# EAGLE design Blinky (EAGLE 7.7.0)
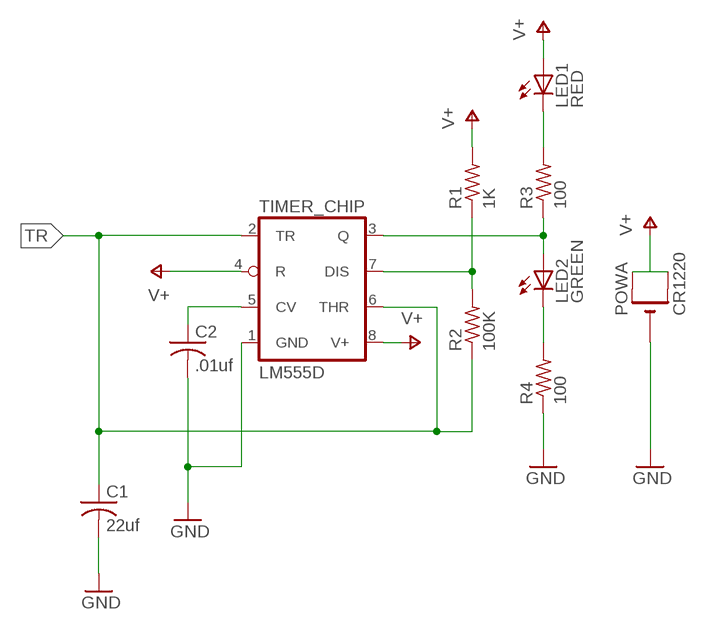
[diagram p0: schematic, sheet 1]

## Parts
C1  22uf  C-USC0805  [C0805]
C2  .01uf  C-USC0805  [C0805]
LED1  RED  LEDCHIP-LED0805  [CHIP-LED0805]
LED2  GREEN  LEDCHIP-LED0805  [CHIP-LED0805]
POWA  CR1220  CR1220SMT  [CR1220-SMD]
R1  1K  R-US_R0805  [R0805]
R2  100K  R-US_R0805  [R0805]
R3  100  R-US_R0805  [R0805]
R4  100  R-US_R0805  [R0805]
TIMER_CHIP  LM555D  [SO08]

## Nets
GND: C1.2 C2.2 POWA.- R4.1 TIMER_CHIP.1(GND)
N$1: LED1.C R3.2
N$2: LED2.A R3.1 TIMER_CHIP.3(Q)
N$3: LED2.C R4.2
N$5: R1.1 R2.2 TIMER_CHIP.7(DIS)
N$6: C2.1 TIMER_CHIP.5(CV)
TR: C1.1 R2.1 TIMER_CHIP.2(TR) TIMER_CHIP.6(THR)
V+: LED1.A POWA.+$1(+) POWA.+$2(+1) R1.2 TIMER_CHIP.4(R) TIMER_CHIP.8(V+)

## Library data of the parts
C1 = adafruit:C-US: CAPACITOR, American symbol; MF: AVX; MPN: 08056D226MAT2A; OC_FARNELL: 1867955
C2 = adafruit:C-US: CAPACITOR, American symbol; MF: AVX; MPN: 08051A101J4T4A; OC_FARNELL: 2410409
LED1 = adafruit:LED: LED OSRAM: - CHIPLED LG R971, LG N971, LY N971, LG Q971, LY Q971, LO R971, LY R971 LH N974, LH R974 LS Q976, LO Q976, LY Q976 LO Q996 - Hyper CHIPLED LW Q18S LB Q993, LB Q99A, LB R99A - SideLED LS A670, LO A670, LY A670, LG A670, LP A670 LB A673, LV A673, LT A673, LW A673 LH A674 LY A675 LS A676, LA A676, LO A676, LY A676, LW A676 LS A679, LY A679, LG A679 - Hyper Micro SIDELED® LS Y876, LA Y876, LO Y876, LY Y876 LT Y87S - SmartLED LW L88C, LW L88S LB L89C, LB L89S, LG L890 LS L89K, LO L89K, LY L89K LS L896, LA L896, LO L896, LY L896 - TOPLED LS T670, LO T670, LY T670, LG T670, LP T670 LSG T670, LSP T670, LSY T670, LOP T670, LYG T670 LG T671, LOG T671, LSG T671 LB T673, LV T673, LT T673, LW T673 LH T674 LS T676, LA T676, LO T676, LY T676, LB T676, LH T676, LSB T676, LW T676 LB T67C, LV T67C, LT T67C, LS T67K, LO T67K, LY T67K, LW E67C LS E67B, LA E67B, LO E67B, LY E67B, LB E67C, LV E67C, LT E67C LW T67C LS T679, LY T679, LG T679 LS T770, LO T770, LY T770, LG T770, LP T770 LB T773, LV T773, LT T773, LW T773 LH T774 LS E675, LA E675, LY E675, LS T675 LS T776, LA T776, LO T776, LY T776, LB T776 LHGB T686 LT T68C, LB T68C - Hyper Mini TOPLED® LB M676 - Mini TOPLED Santana® LG M470 LS M47K, LO M47K, LY M47K Source: http://www.osram.convergy.de/; MF: MULTICOMP; MPN: MCL-S270SRC; OC_FARNELL: 1581239
LED2 = adafruit:LED: LED OSRAM: - CHIPLED LG R971, LG N971, LY N971, LG Q971, LY Q971, LO R971, LY R971 LH N974, LH R974 LS Q976, LO Q976, LY Q976 LO Q996 - Hyper CHIPLED LW Q18S LB Q993, LB Q99A, LB R99A - SideLED LS A670, LO A670, LY A670, LG A670, LP A670 LB A673, LV A673, LT A673, LW A673 LH A674 LY A675 LS A676, LA A676, LO A676, LY A676, LW A676 LS A679, LY A679, LG A679 - Hyper Micro SIDELED® LS Y876, LA Y876, LO Y876, LY Y876 LT Y87S - SmartLED LW L88C, LW L88S LB L89C, LB L89S, LG L890 LS L89K, LO L89K, LY L89K LS L896, LA L896, LO L896, LY L896 - TOPLED LS T670, LO T670, LY T670, LG T670, LP T670 LSG T670, LSP T670, LSY T670, LOP T670, LYG T670 LG T671, LOG T671, LSG T671 LB T673, LV T673, LT T673, LW T673 LH T674 LS T676, LA T676, LO T676, LY T676, LB T676, LH T676, LSB T676, LW T676 LB T67C, LV T67C, LT T67C, LS T67K, LO T67K, LY T67K, LW E67C LS E67B, LA E67B, LO E67B, LY E67B, LB E67C, LV E67C, LT E67C LW T67C LS T679, LY T679, LG T679 LS T770, LO T770, LY T770, LG T770, LP T770 LB T773, LV T773, LT T773, LW T773 LH T774 LS E675, LA E675, LY E675, LS T675 LS T776, LA T776, LO T776, LY T776, LB T776 LHGB T686 LT T68C, LB T68C - Hyper Mini TOPLED® LB M676 - Mini TOPLED Santana® LG M470 LS M47K, LO M47K, LY M47K Source: http://www.osram.convergy.de/; MF: MULTICOMP; MPN: OVS-0804; OC_FARNELL: 1716766
POWA = adafruit:CR1220: CR1216/CR1220/CR1225 12mm 3V lithium coin cell Great for battery packup. Both SMT and THM holders. Note the THM package has the ground pads on both sides of the PCB so that the masks are the same - this reduces the cost; MF: HARWIN; MPN: S8411-45R; OC_FARNELL: 2411190
R1 = adafruit:R-US_: RESISTOR, American symbol; MF: VISHAY; MPN: CRCW08051K00FKTA; OC_FARNELL: 1652936
R2 = adafruit:R-US_: RESISTOR, American symbol; MF: VISHAY; MPN: CRCW0805100KFKTA; OC_FARNELL: 1652905
R3 R4 = adafruit:R-US_: RESISTOR, American symbol; MF: VISHAY; MPN: CRCW0805100RFKTA; OC_FARNELL: 1652906
TIMER_CHIP = adafruit:*555: TIMER Changed DIP package to have round (not oval) pin pads http://www.ladyada.net/library/pcb/eaglelibrary.html; MF: TEXAS INSTRUMENTS; MPN: SA555D; OC_FARNELL: 9589945

## Net classes
0 default: width 0.305 mm, drill 0.508 mm, clearance 0.254 mm

## Board
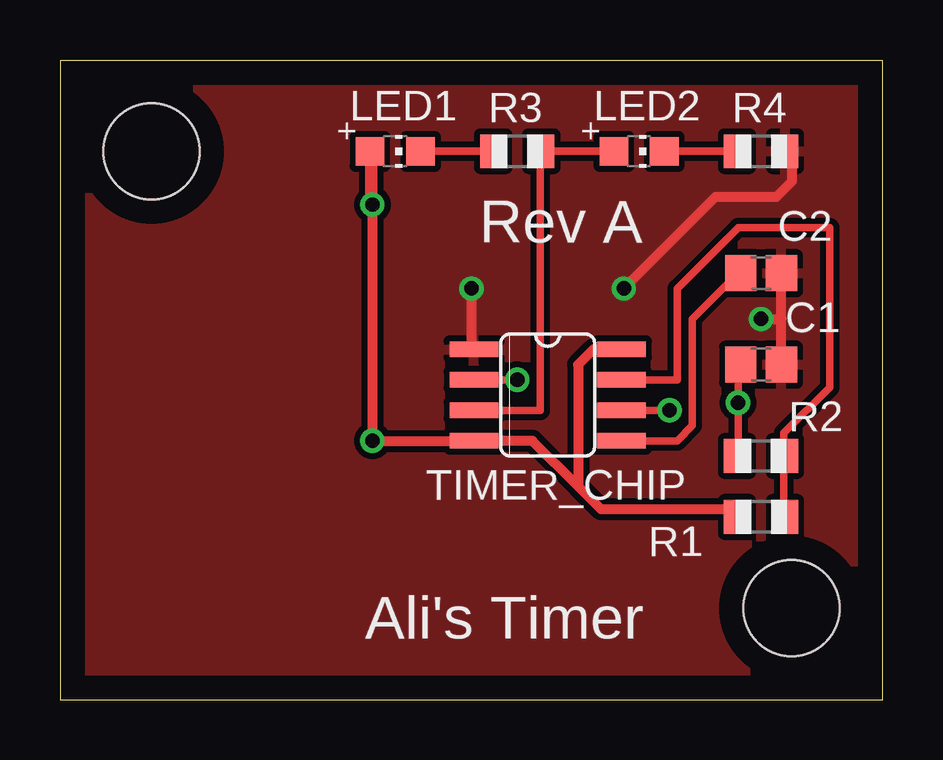
[diagram p1: board, top side]
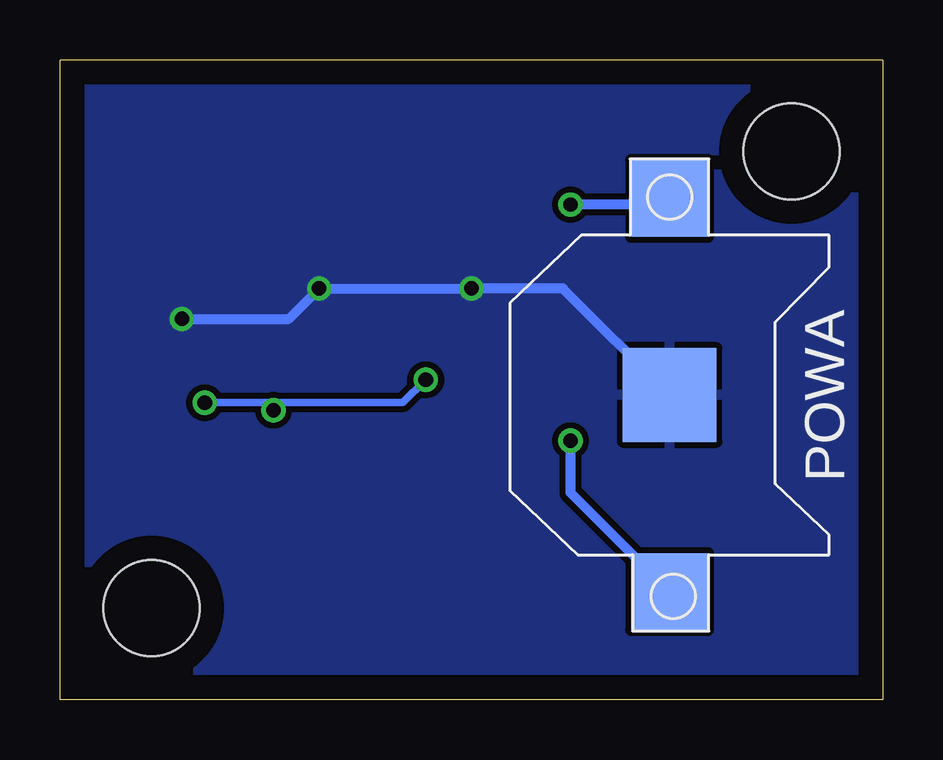
[diagram p2: board, bottom side, seen from below]

Size 34.29 x 26.67 mm. Coordinates in mm from the lower left corner, seen from the top.
Outline: 34.28,26.66 34.28,0 0,0 0,26.66 34.29,26.67
Copper layers (1*16): Top 0.035mm / dielectric 1.5mm / Bottom 0.035mm
Design rules "default *": minimum track width 10mil, minimum drill 20mil, track to track 8mil, track to pad 8mil, pad to pad 8mil, via to via 8mil, smd to smd 8mil, copper to edge 40mil, drill to drill 8mil, minimum pad ring 10mil, minimum via ring 8mil, stop-mask expansion 4mil, vias tented up to drill 0mil, thermal gap 10mil
Holes 4 mm at 3.81,22.86 30.48,3.81

### Footprints (pad centres in the part's own frame; a part is rotated, then mirrored left to right if it is on the bottom)
C0805 = smd 1.3 x 1.5: 1 -0.85,0; 2 0.85,0
CHIP-LED0805 = smd 1.2 x 1.2: A 0,-1.05; C 0,1.05
CR1220-SMD = smd 3.2 x 3.2: +$1 -8.2,0; +$2 8.2,0 | smd 3.9 x 3.9: - 0,0
R0805 = smd 1.1 x 1.4: 1 -1,0; 2 1,0
SO08 = smd 0.66 x 2.032: 1 -1.905,-3.073; 2 -0.635,-3.073; 3 0.635,-3.073; 4 1.905,-3.073; 5 1.905,3.073; 6 0.635,3.073; 7 -0.635,3.073; 8 -1.905,3.073

### Placement (x,y rotation side)
C1  29.21,13.97 0 top
C2  29.21,17.78 0 top
LED1  13.97,22.86 270 top
LED2  24.13,22.86 270 top
POWA  8.89,12.7 270 bottom
R1  29.21,7.62 180 top
R2  29.21,10.16 0 top
R3  19.05,22.86 180 top
R4  29.21,22.86 180 top
TIMER_CHIP  20.32,12.7 270 top

### Tracks (layer width: path | path; a pad name or v marks a point on that pad's centre or on a via)
GND  (via drill 0.6)
  Top 0.406: C1.2 30.06,15.88 | 30.06,15.88 C2.2 | v29.21,15.88 30.06,15.88 | v17.14,17.14 17.14,14.71 TIMER_CHIP.1 | R4.1 30.48,22.86 30.48,21.59 29.84,20.96 27.3,20.96 v23.5,17.14
  Bottom 0.406: v29.21,15.88 24.77,15.88 v23.5,17.14 v17.14,17.14 13.34,17.14 POWA.-
  pour Bottom: 0,26.67 34.29,26.67 34.29,0 0,0
  pour Top: 0,26.67 34.29,26.67 34.29,0 0,0
N$1
  Top 0.305: R3.2 LED1.C
N$2
  Top 0.305: LED2.A R3.1 20,22.86 20,12.07 TIMER_CHIP.3
N$3
  Top 0.305: R4.2 LED2.C
N$5
  Top 0.305: 30.16,10.16 30.16,7.62 R1.1 | TIMER_CHIP.7 25.72,13.34 25.72,17.14 28.26,19.68 32.07,19.68 32.07,13.02 30.16,11.11 30.16,10.16 | 30.16,10.16 R2.2
N$6
  Top 0.305: TIMER_CHIP.5 25.72,10.79 26.35,11.43 26.35,15.88 28.26,17.78 C2.1
TR  (via drill 0.61)
  Top 0.305: R2.1 28.26,10.16 v28.26,12.38 28.26,13.97 C1.1 | v19.05,13.34 TIMER_CHIP.2 | v25.4,12.07 TIMER_CHIP.6
  Bottom 0.305: v19.05,13.34 20,12.38 25.4,12.38 | v28.26,12.38 25.4,12.38 | 25.4,12.38 v25.4,12.07
V+  (via drill 0.6)
  Top 0.406: v13.02,20.64 12.92,20.73 LED1.A 13.02,22.76 v13.02,10.79 TIMER_CHIP.4 19.68,10.79 21.59,8.89 | TIMER_CHIP.8 22.23,14.61 21.59,13.97 21.59,8.89 | R1.2 27.89,7.94 22.54,7.94 21.59,8.89
  Bottom 0.406: POWA.+$1 9.15,20.64 v13.02,20.64 | POWA.+$2 13.02,8.63 v13.02,10.79

### Text on the board
tPlace: Rev A | Ali's Timer